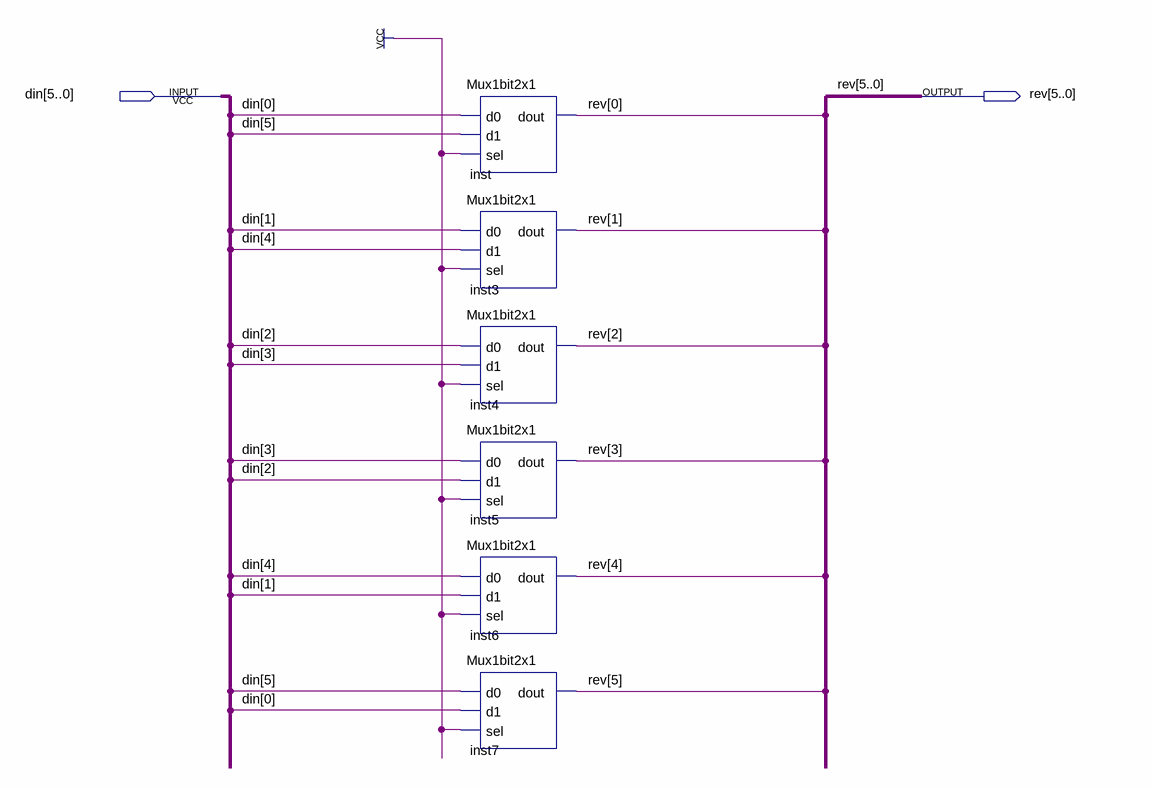
[diagram p0: schematic sheet]
// Quartus schematic Reverser6bit.bdf as structural Verilog: 6 symbols, 2 pins
module Reverser6bit (
  input  [5:0] din,
  output [5:0] rev
);

  Mux1bit2x1 inst (.d0(din[0]), .d1(din[5]), .sel(1'b1), .dout(rev[0]));
  Mux1bit2x1 inst3 (.d0(din[1]), .d1(din[4]), .sel(1'b1), .dout(rev[1]));
  Mux1bit2x1 inst4 (.d0(din[2]), .d1(din[3]), .sel(1'b1), .dout(rev[2]));
  Mux1bit2x1 inst5 (.d0(din[3]), .d1(din[2]), .sel(1'b1), .dout(rev[3]));
  Mux1bit2x1 inst6 (.d0(din[4]), .d1(din[1]), .sel(1'b1), .dout(rev[4]));
  Mux1bit2x1 inst7 (.d0(din[5]), .d1(din[0]), .sel(1'b1), .dout(rev[5]));
endmodule
